# EAGLE design photodiode_r1 (EAGLE 6.5.0)
DESIGNER: JONATHAN P. NEWMAN; DOC_NUMBER: N/A; REVISION: 3.1
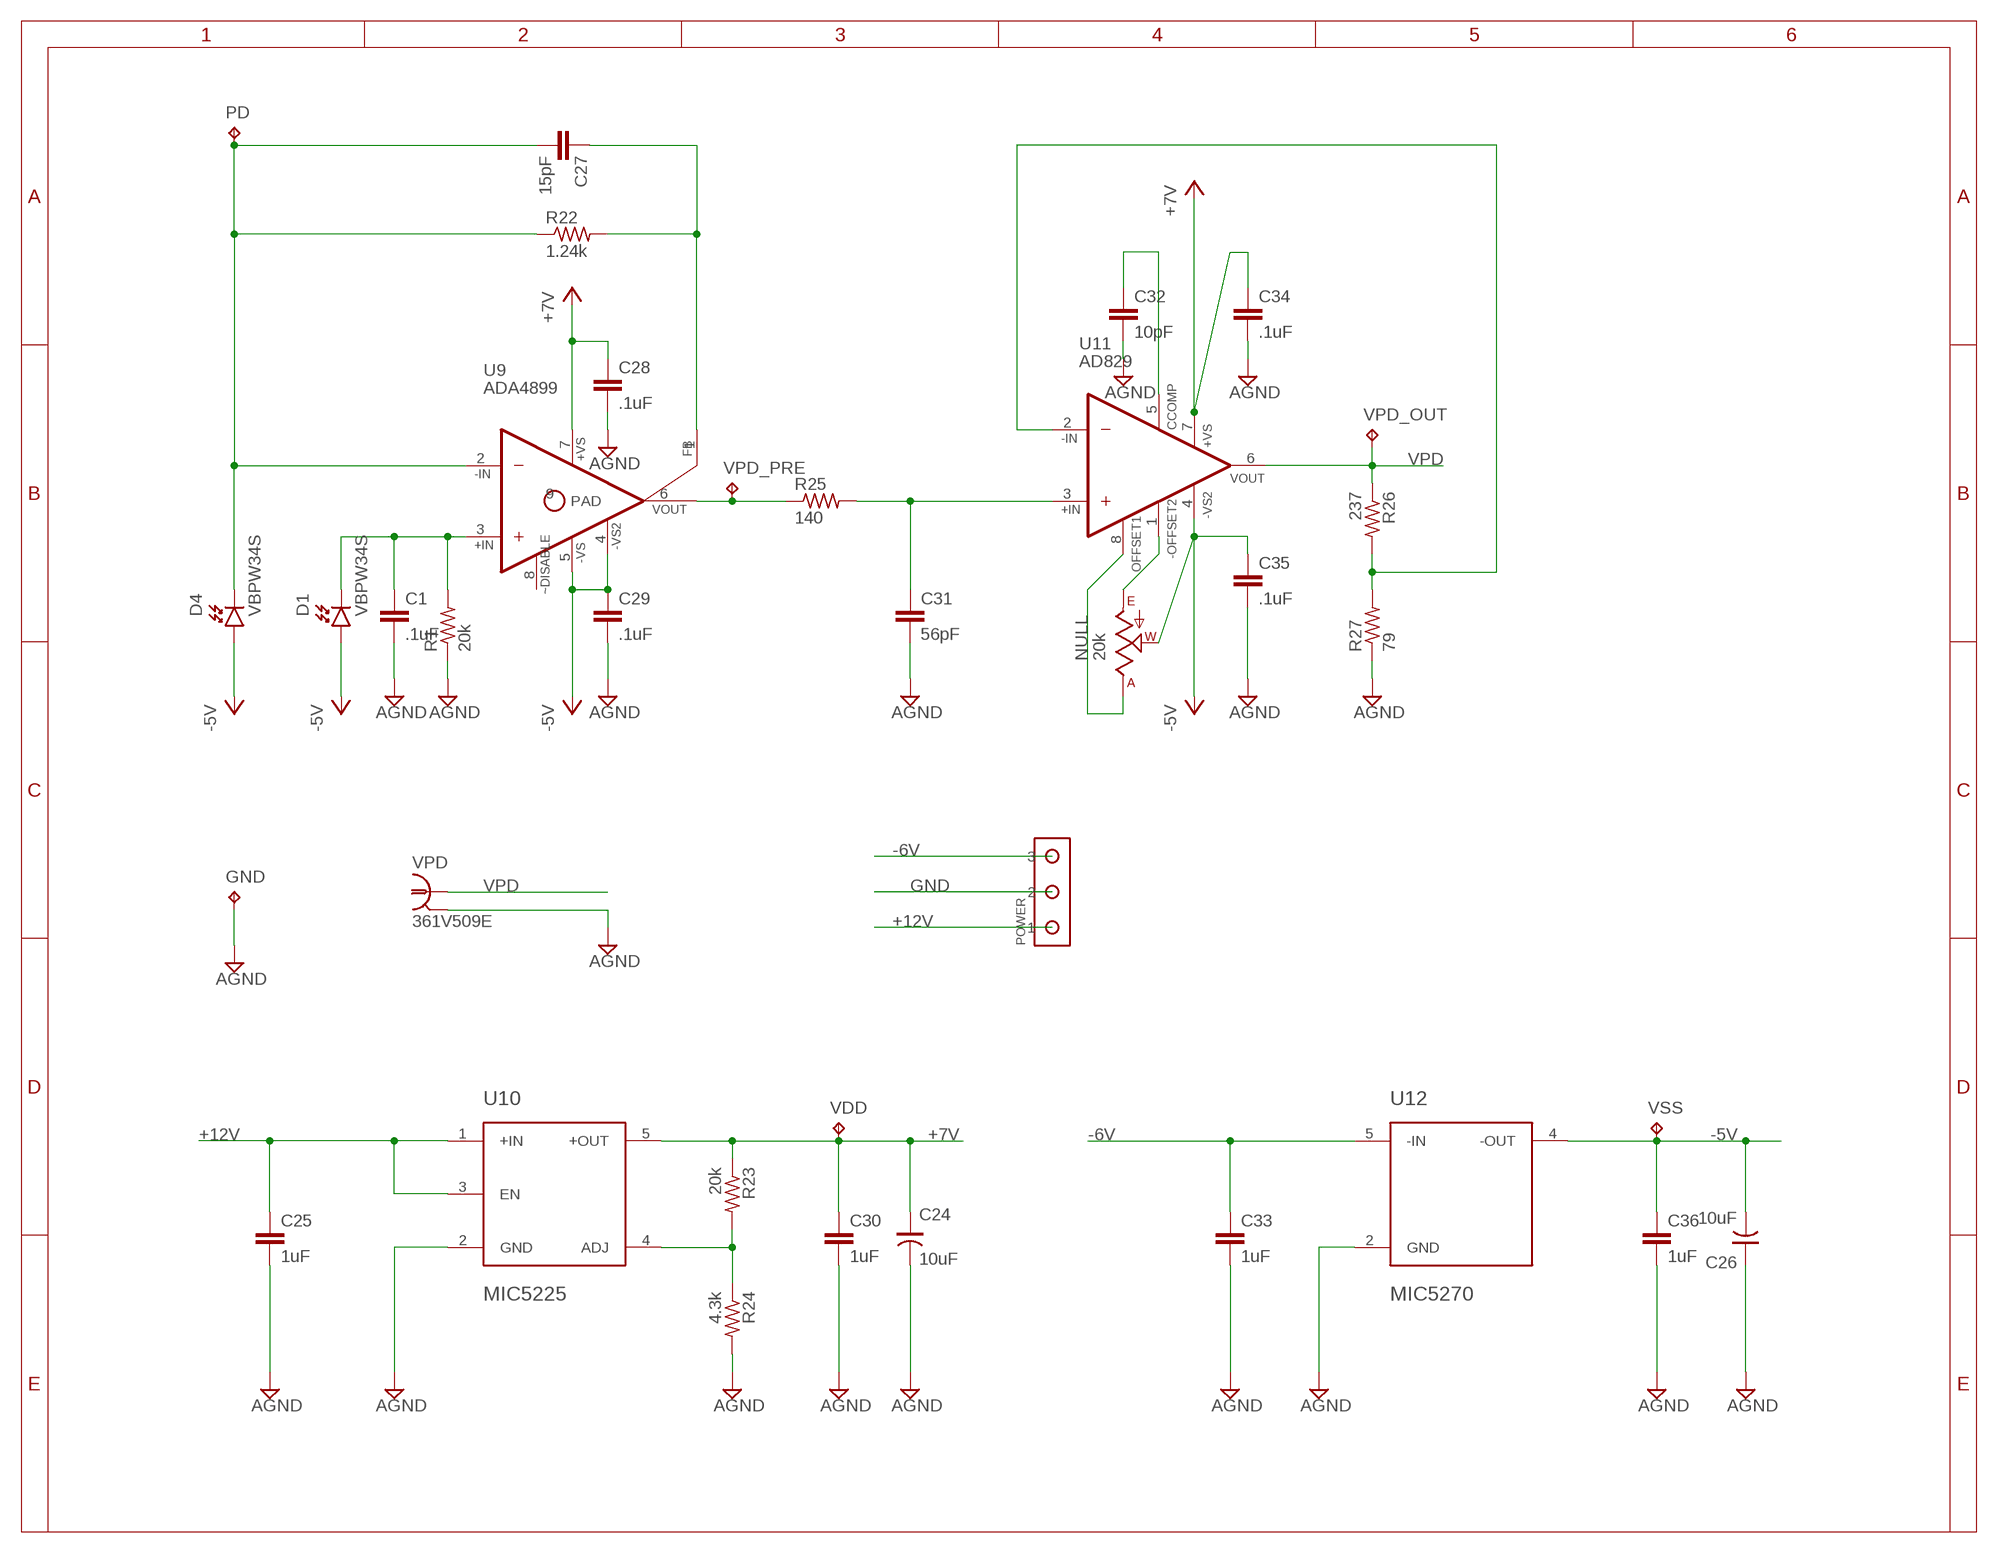
[diagram p0: schematic, sheet 1]

## Parts
C1  .1uF  C_0603  [0603]
C24  10uF  C-POL_6032M  [6032M-POL]
C25  1uF  C_0805  [0805]
C26  10uF  C-POL_6032M  [6032M-POL]
C27  15pF  C_0603  [0603]
C28  .1uF  C_0603  [0603]
C29  .1uF  C_0603  [0603]
C30  1uF  C_0805  [0805]
C31  56pF  C_0603  [0603]
C32  10pF  C_0603  [0603]
C33  1uF  C_0805  [0805]
C34  .1uF  C_0603  [0603]
C35  .1uF  C_0603  [0603]
C36  1uF  C_0805  [0805]
D1  VBPW34S  PHOTODIODE_VBPW34S  [VBPW34S]
D4  VBPW34S  PHOTODIODE_VBPW34S  [VBPW34S]
GND  TPTP08R  [TP08R]
NULL  20k  TRIM_US-SM-42/43A  [SM-42/43A]
PD  TPTP08R  [TP08R]
POWER  S2B-PH-K-S  SCREW3  [SCREW3]
R1  20k  R_0603  [0603]
R22  1.24k  R_0603  [0603]
R23  20k  R_0603  [0603]
R24  4.3k  R_0603  [0603]
R25  140  R_0603  [0603]
R26  237  R_0603  [0603]
R27  79  R_0603  [0603]
U9  ADA4899  ADA4899-1YRDZ  [SOIC127P600X175-9N]
U10  MIC5225  [SOT65P210X110-5N]
U11  AD829  AD829JRZ  [SOIC127P600X175-8N]
U12  MIC5270  MIC5270-5.0  [SOT65P210X110-5N]
VDD  TPTP08R  [TP08R]
VPD  361V509E  BNC_V-BITE  [361V509E]
VPD_OUT  TPTP08R  [TP08R]
VPD_PRE  TPTP08R  [TP08R]
VSS  TPTP08R  [TP08R]

## Nets
+7V: C24.+ C28.1 C30.1 C34.1 R23.1 U9.7(+VS) U10.5(+OUT) U11.7(+VS) VDD.TP
+12V [pwr]: C25.1 POWER.P$1 U10.1(+IN) U10.3(EN)
-5V: C26.- C29.1 C35.1 C36.1 D1.A D4.A NULL.2(W) U9.4(-VS_2) U9.5(-VS) U11.4(-VS) U12.4(-OUT) VSS.TP
-6V: C33.1 POWER.P$3 U12.5(-IN)
AGND: C1.2 R1.1
GND: C24.- C25.2 C26.+ C28.2 C29.2 C30.2 C31.2 C32.2 C33.2 C34.2 C35.2 C36.2 GND.TP POWER.P$2 R24.2 R27.1 U10.2(GND) U12.2(GND) VPD.2 VPD.3 ; supply symbol labelled AGND
N$1: C1.1 D1.C R1.2 U9.3(+IN)
N$16: C27.1 R22.2 U9.1(FEEDBACK)
N$17: C27.2 D4.C PD.TP R22.1 U9.2(-IN)
N$18: NULL.3(E) U11.1(OFS_2)
N$21: R25.1 U9.6(VOUT) VPD_PRE.TP
N$23: R23.2 R24.1 U10.4(ADJ)
N$24: R26.2 R27.2 U11.2(-IN)
N$25: NULL.1(A) U11.8(OFS)
N$26: C32.1 U11.5(CCOMP)
VPD: R26.1 U11.6(OUTPUT) VPD.1 VPD_OUT.TP
VPD_PRE: C31.1 R25.2 U11.3(+IN)
Unconnected: U9.8(~DISABLE) U9.9(PAD)

## Library data of the parts
C1 C27-C29 C31 C32 C34 C35 = cyclops:C: Capacitor
C24 C26 = cyclops:C-POL: Polarized Capacitor
C25 C30 C33 C36 = cyclops:C: Capacitor; MN: TDK Corp.; PARTNO: C2012X5R1Cxxxxxxx; VID: DK
D1 D4 = cyclops:PHOTODIODE
GND PD VDD VPD_OUT VPD_PRE VSS = cyclops:TP: Test pad
NULL = cyclops:TRIM_US-: POTENTIOMETER
POWER = cyclops:SCREW3: Screw Terminal
R1 R22-R27 = cyclops:R: Resistor; DK: PxxxxHTR-ND; MN: Panasonic; MPN: ERJ-3EKFxxxxV
U9 = cyclops:ADA4899-1YRDZ: Unity-Gain Stable, Ultralow Distortion, 1 nV/ãHz Voltage Noise, High Speed Op Amp; MPN: ADA4899-1YRDZ; OC_FARNELL: 1274191; OC_NEWARK: 19M0651; PACKAGE: SOIC-8; SUPPLIER: Analog Devices
U10 = cyclops:MIC5225
U11 = cyclops:AD829JRZ: High Speed, Low Noise Video Op Amp; MPN: AD829JRZ; OC_FARNELL: 1651321; OC_NEWARK: 19M8894; PACKAGE: SOIC-8; SUPPLIER: Analog Devices
U12 = cyclops:MIC5270-5.0: Negative 5V fixed LDO voltage regulator
VPD = cyclops:BNC: BNC CONNECTOR M/A COM www.macom.com distributor Farnell 149-452

## Board
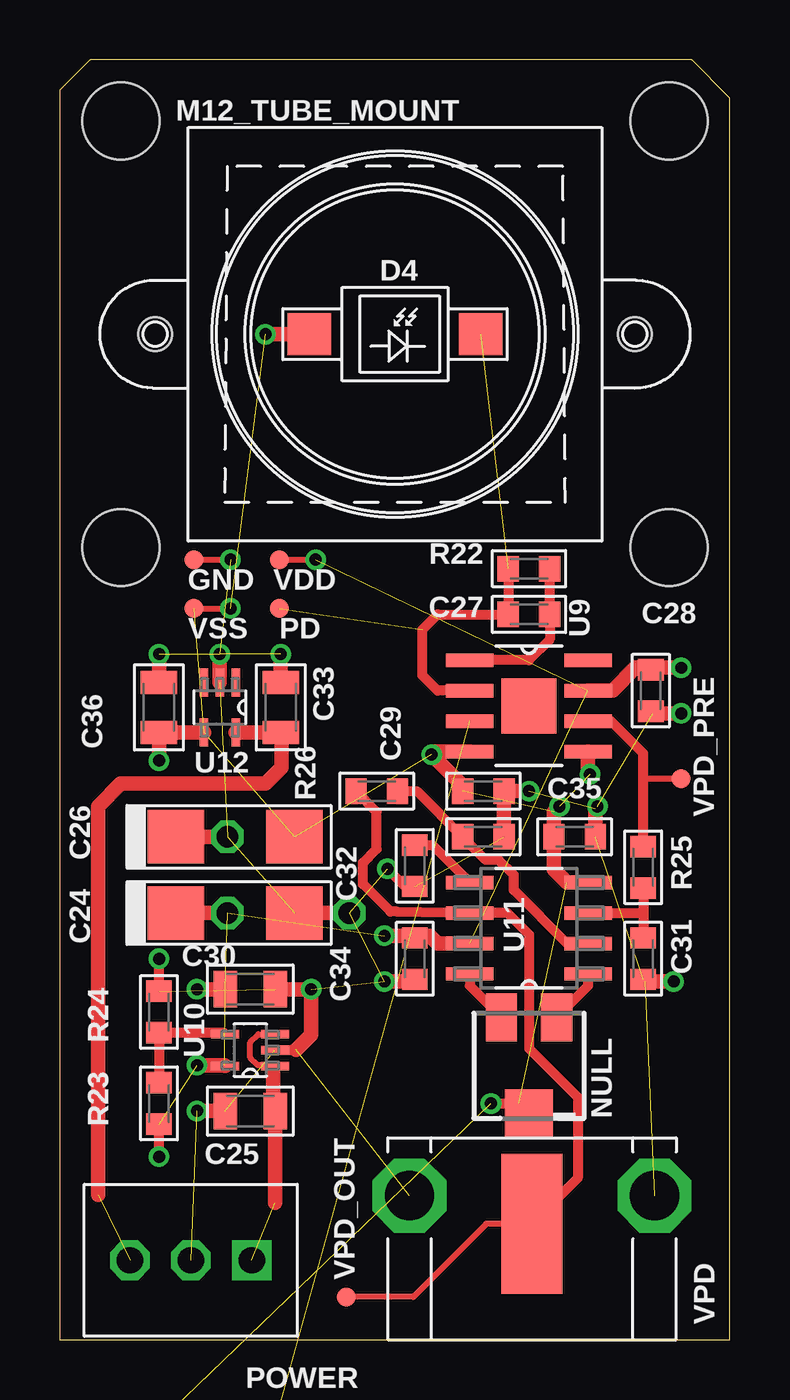
[diagram p1: board, top side]
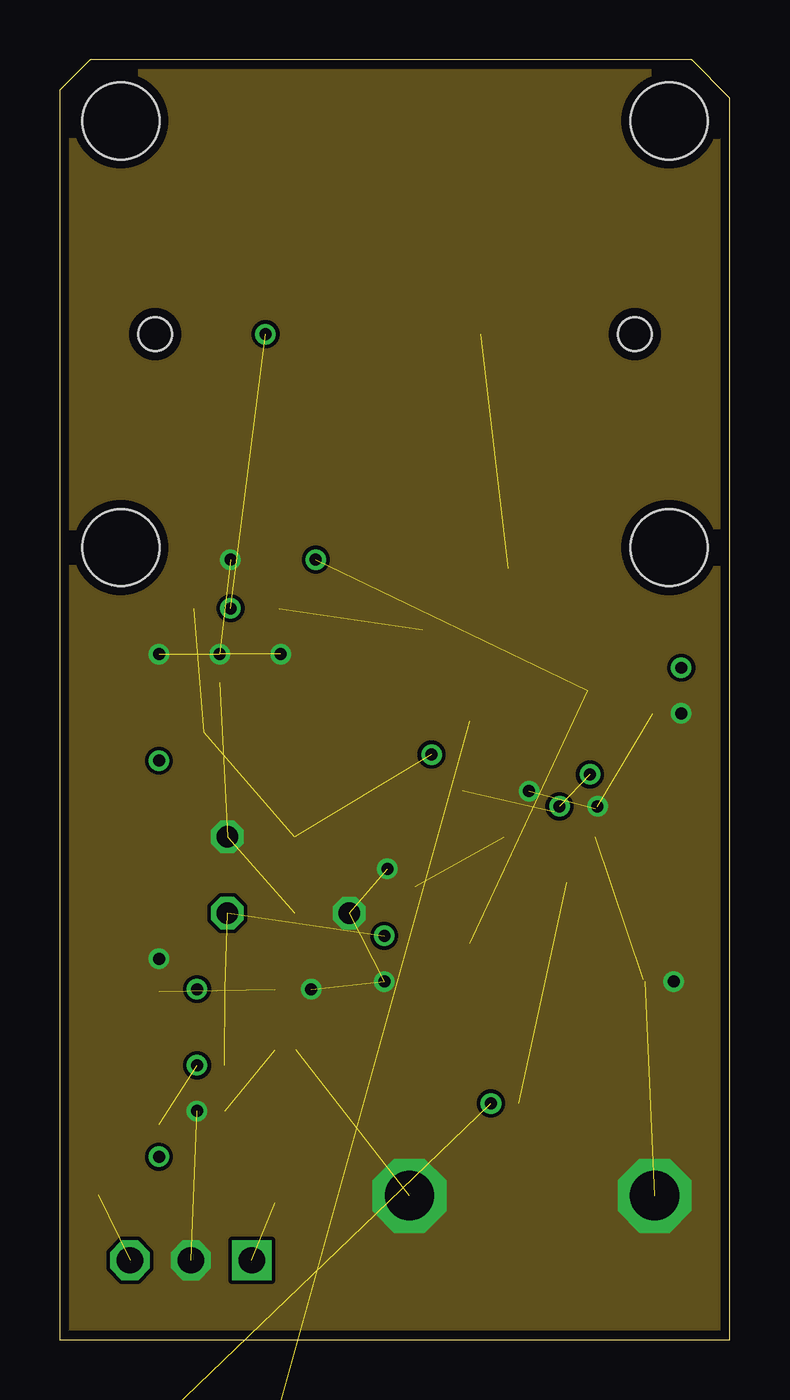
[diagram p2: board, inner layer Route2]
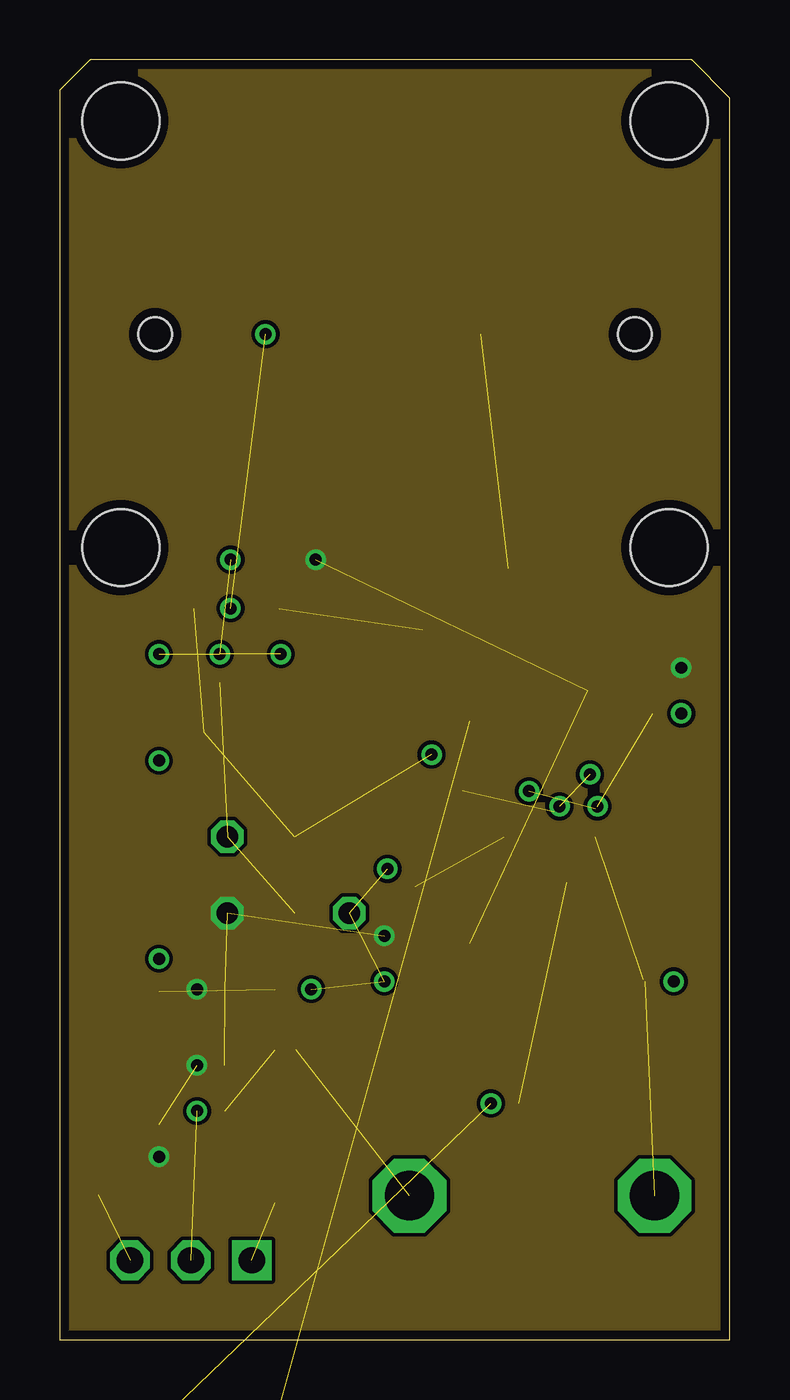
[diagram p3: board, inner layer Route15]
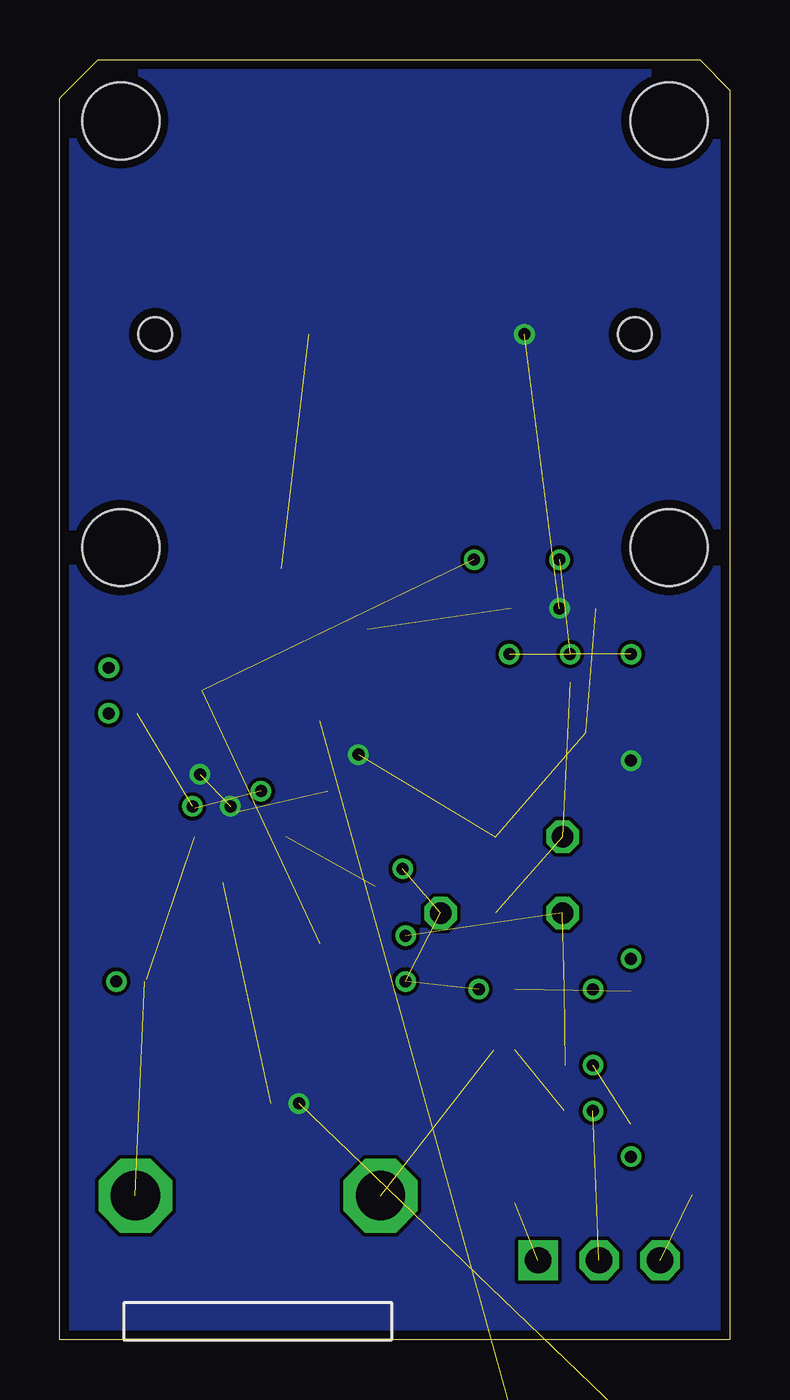
[diagram p4: board, bottom side, seen from below]

Size 27.94 x 53.34 mm. Coordinates in mm from the lower left corner, seen from the top.
Outline: 27.94,0 27.94,51.75 26.35,53.34 1.27,53.34 0,52.07 0,0 27.94,0
Copper layers (1+2*15+16): Top 0.0356mm / dielectric 1.5011mm / Route2 0.0356mm / dielectric 0.1499mm / Route15 0.0356mm / dielectric 0.2007mm / Bottom 0.0356mm
Design rules "ohs-park-mod-4layer_tented-vias": minimum track width 6mil, minimum drill 13mil, track to track 6mil, track to pad 6mil, pad to pad 6mil, via to via 6mil, smd to smd 6mil, copper to edge 15mil, drill to drill 6mil, minimum pad ring 7mil, minimum via ring 7mil, stop-mask expansion 4mil, vias tented up to drill 100mil, thermal gap 10mil
Holes 3.2 mm at 25.4,50.8 2.54,50.8 2.54,33.02 25.4,33.02

### Footprints (pad centres in the part's own frame; a part is rotated, then mirrored left to right if it is on the bottom)
0603 = smd 0.889 x 1.067: 1 -0.864,0; 2 0.864,0
6032M-POL = smd 2.37 x 2.23: + -2.47,0; - 2.47,0
0805 = smd 0.965 x 1.524: 1 -1.041,0; 2 1.041,0
VBPW34S = smd 1.8 x 1.75: A -3.575,0; C 3.575,0
TP08R = smd 0.8 x 0.8: TP 0,0
PT-LH001 = hole 1.4: -10,0; 10,0
SM-42/43A = smd 2 x 1.3: 1 2,1.15; 3 2,-1.15 | smd 2 x 2: 2 -2,0
SCREW3 = drill 1.1 square: P$1 0,0 | drill 1.1 octagon: P$2 2.54,0; P$3 5.08,0
SOIC127P600X175-9N = smd 1.981 x 0.559: 1 -2.464,1.905; 2 -2.464,0.635; 3 -2.464,-0.635; 4 -2.464,-1.905; 5 2.464,-1.905; 6 2.464,-0.635; 7 2.464,0.635; 8 2.464,1.905 | smd 2.286 x 2.286: 9 0,0
SOT65P210X110-5N = smd 1.168 x 0.356: 1 -1.041,0.66; 2 -1.041,0; 3 -1.041,-0.66; 4 1.041,-0.66; 5 1.041,0.66
SOIC127P600X175-8N = smd 1.981 x 0.559: 1 -2.464,1.905; 2 -2.464,0.635; 3 -2.464,-0.635; 4 -2.464,-1.905; 5 2.464,-1.905; 6 2.464,-0.635; 7 2.464,0.635; 8 2.464,1.905
361V509E = smd 2.54 x 5.842: 1 0,4.826 | drill 2.057 octagon: 2 -5.112,5.994; 3 5.112,5.994

### Placement (x,y rotation side)
C1  5.46,-11.43 0 top  (outside the outline)
C24  7.3,17.78 0 top
C25  7.94,9.53 180 top
C26  7.3,20.95 0 top
C27  19.56,30.23 180 top
C28  24.64,27.05 270 top
C29  17.65,22.86 0 top
C30  7.94,14.61 0 top
C31  24.32,15.88 270 top
C32  14.8,19.75 270 top
C33  9.21,26.35 90 top
C34  14.8,15.88 270 top
C35  21.46,20.95 0 top
C36  4.13,26.35 90 top
D1  4.57,-6.48 0 top  (outside the outline)
D4  13.97,41.91 0 top
GND  5.59,32.51 0 top
M12_TUBE_MOUNT  PT-LH001  [PT-LH001]  13.97,41.91 0 top
NULL  19.56,11.43 90 top
PD  9.14,30.48 0 top
POWER  8,3.3 180 top
R1  5.46,-13.33 0 top  (outside the outline)
R22  19.56,32.13 0 top
R23  4.13,9.84 90 top
R24  4.13,13.65 90 top
R25  24.32,19.69 270 top
R26  13.21,22.86 0 top
R27  17.65,20.95 180 top
U9  19.56,26.42 0 top
U10  7.94,12.07 180 top
U11  19.56,17.15 180 top
U12  6.67,26.35 270 top
VDD  9.14,32.51 0 top
VPD  19.68,0 0 top
VPD_OUT  11.94,1.78 90 top
VPD_PRE  25.91,23.37 90 top
VSS  5.59,30.48 0 top

### Tracks (layer width: path | path; a pad name or v marks a point on that pad's centre or on a via)
+7V  (via drill 0.5, 0.9)  (6 unrouted)
  Top 0.254: VDD.TP v10.67,32.51
  Top 0.406: v4.13,7.62 R23.1
  Top 0.61: v6.98,17.78 C24.+ | U11.7 15.75,16.51 15.43,16.83 14.88,16.83 C34.1 14.71,16.83 v13.53,16.83 | U9.7 23.05,27.05 24,28 24.55,28 C28.1 24.73,28 v25.91,28 | v5.71,14.61 C30.1 | U10.5 6.87,11.43 v5.71,11.43
  pour Route15 (no thermals): 0,53.34 27.94,53.34 27.94,0 0,0
+12V  (1 unrouted)
  Top 0.254: U10.1 8.95,11.43 8.25,11.43 7.94,11.75 7.94,12.38 8.28,12.73 U10.3
  Top 0.305: 8.89,11.11 8.98,11.2 U10.1 | C25.1 8.89,9.53
  Top 0.61: C25.1 8.98,5.71 | 8.89,9.53 8.89,11.11
-5V  (via drill 0.5)  (8 unrouted)
  Top 0.254: VSS.TP v7.11,30.48
  Top 0.406: v17.97,9.84 19.14,9.84 NULL.2
  Top 0.61: D4.A v8.57,41.91 | v22.1,23.56 22.02,23.64 U9.5 | v20.83,22.23 20.6,22 C35.1 20.6,19.6 21.14,19.05 U11.4 | v4.13,24.13 C36.1 U12.4 | U9.4 15.62,24.51 v15.49,24.38 16.79,23.09 C29.1
  pour Bottom (no thermals): 0,53.34 27.94,53.34 27.94,0 0,0
-6V  (1 unrouted)
  Top 0.61: 1.59,6.03 1.59,22.23 2.54,23.18 8.57,23.18 9.23,23.84 9.23,25.29 C33.1 U12.5
AGND  (1 unrouted)
GND  (via drill 0.5, 0.9)  (17 unrouted)
  Top 0.254: GND.TP v7.11,32.51
  Top 0.406: U10.2 9.84,12.07 | R24.2 v4.13,15.88 | C32.2 14.39,18.89 v13.65,19.62
  Top 0.61: C26.+ v6.98,20.95 | C24.- v12.06,17.78 | 9.84,12.07 10.48,12.7 v10.48,14.61 C30.2 | v5.71,9.53 C25.2 | v22.41,22.23 22.33,22.14 C35.2 | v25.59,14.92 24.41,14.92 C31.2 | v13.53,14.92 14.71,14.92 C34.2 | v25.91,26.1 24.73,26.1 C28.2 | R27.1 C29.2 v19.56,22.86 | v4.13,28.58 C36.2 | v9.21,28.58 C33.2 | U12.2 v6.67,28.58
  pour Route2 (no thermals): 0,53.34 27.94,53.34 27.94,0 0,0
N$1  (3 unrouted)
N$16
  Top 0.406: R22.2 C27.1 20.42,29.19 19.56,28.32 U9.1
N$17  (2 unrouted)
  Top 0.406: R22.1 C27.2 15.75,30.23 15.11,29.59 15.11,27.69 15.75,27.05 U9.2
N$18
  Top 0.406: U11.1 22.02,14.74 NULL.3
N$21
  Top 0.254: VPD_PRE.TP 24.32,23.37 24.32,23.11
  Top 0.406: R25.1 24.32,23.11 24.32,24.43 22.97,25.78 U9.6
N$23
  Top 0.406: U10.4 6.83,12.79 R24.1 R23.2
N$24
  Top 0.406: U11.2 21.14,16.51 18.92,18.73 18.92,19.37 18.29,20 17.74,20 R27.2 14.88,22.86 R26.2
N$25
  Top 0.406: U11.8 17.09,14.74 NULL.1
N$26
  Top 0.406: C32.1 15.53,20.61 U11.5
VPD
  Top 0.254: VPD.1 17.78,4.83 14.73,1.78 VPD_OUT.TP
  Top 0.406: VPD.1 21.59,6.73 21.59,10.1 19.56,12.13 19.56,16.88 18.66,17.78 U11.6 14.06,17.84 13.78,17.84 12.64,18.99 12.64,19.88 13.21,20.45 13.21,22 R26.1
VPD_PRE
  Top 0.406: R25.2 24.32,17.78 | 24.32,17.78 C31.1 | U11.3 24.32,17.78